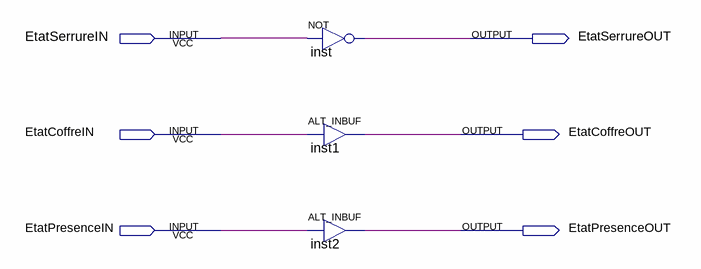
[diagram p0: schematic sheet]
// Quartus schematic AffichageEtats.bdf as structural Verilog: 3 symbols, 6 pins
module AffichageEtats (
  input  EtatSerrureIN,
  input  EtatCoffreIN,
  input  EtatPresenceIN,
  output EtatSerrureOUT,
  output EtatCoffreOUT,
  output EtatPresenceOUT
);

  not inst (EtatSerrureOUT, EtatSerrureIN);
  ALT_INBUF inst1 (.i(EtatCoffreIN), .o(EtatCoffreOUT));
  ALT_INBUF inst2 (.i(EtatPresenceIN), .o(EtatPresenceOUT));
endmodule
